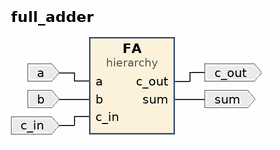
[diagram p0: block diagram of the top level]
# Vivado block design full_adder, xc7z020clg400-1, Vivado 2022.1
create_bd_design full_adder

create_bd_port -dir I a
create_bd_port -dir I b
create_bd_port -dir O c_out
create_bd_port -dir O sum
create_bd_port -dir I c_in

create_bd_cell -type hier FA

# ---- hierarchy /FA ----
current_bd_instance /FA
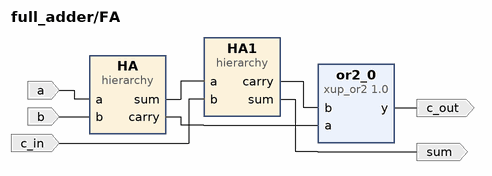
[diagram p1: block diagram inside /FA]
create_bd_pin -dir O c_out
create_bd_pin -dir I a
create_bd_pin -dir I b
create_bd_pin -dir I c_in
create_bd_pin -dir O sum

create_bd_cell -type ip -vlnv xilinx.com:xup:xup_or2:1.0 or2_0
set_property -dict {CONFIG.DELAY 0} [get_bd_cells or2_0]
create_bd_cell -type hier HA
create_bd_cell -type hier HA1

# ---- hierarchy /FA/HA ----
current_bd_instance /FA/HA
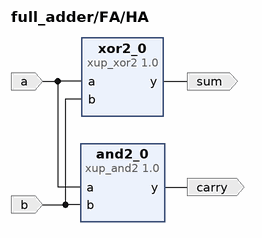
[diagram p2: block diagram inside /FA/HA]
create_bd_pin -dir I a
create_bd_pin -dir I b
create_bd_pin -dir O carry
create_bd_pin -dir O sum

create_bd_cell -type ip -vlnv xilinx.com:xup:xup_and2:1.0 and2_0
set_property -dict {CONFIG.DELAY 0} [get_bd_cells and2_0]
create_bd_cell -type ip -vlnv xilinx.com:xup:xup_xor2:1.0 xor2_0
set_property -dict {CONFIG.DELAY 0} [get_bd_cells xor2_0]

# ---- hierarchy /FA/HA1 ----
current_bd_instance /FA/HA1
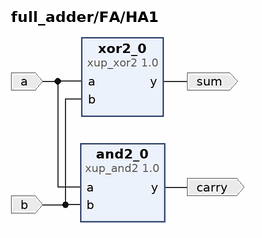
[diagram p3: block diagram inside /FA/HA1]
create_bd_pin -dir I a
create_bd_pin -dir I b
create_bd_pin -dir O carry
create_bd_pin -dir O sum

create_bd_cell -type ip -vlnv xilinx.com:xup:xup_and2:1.0 and2_0
set_property -dict {CONFIG.DELAY 0} [get_bd_cells and2_0]
create_bd_cell -type ip -vlnv xilinx.com:xup:xup_xor2:1.0 xor2_0
set_property -dict {CONFIG.DELAY 0} [get_bd_cells xor2_0]

# ---- connections ----

current_bd_instance /FA
connect_bd_net [get_bd_pins HA1/carry] [get_bd_pins or2_0/b]
connect_bd_net [get_bd_pins HA1/sum] [get_bd_pins sum]
connect_bd_net [get_bd_pins HA/carry] [get_bd_pins or2_0/a]
connect_bd_net [get_bd_pins HA/sum] [get_bd_pins HA1/a]
connect_bd_net [get_bd_pins a] [get_bd_pins HA/a]
connect_bd_net [get_bd_pins b] [get_bd_pins HA/b]
connect_bd_net -net b_2 [get_bd_pins c_in] [get_bd_pins HA1/b]
connect_bd_net [get_bd_pins or2_0/y] [get_bd_pins c_out]

current_bd_instance /FA/HA
connect_bd_net [get_bd_pins a] [get_bd_pins xor2_0/a] [get_bd_pins and2_0/a]
connect_bd_net [get_bd_pins b] [get_bd_pins xor2_0/b] [get_bd_pins and2_0/b]
connect_bd_net -net xup_and2_0_y [get_bd_pins and2_0/y] [get_bd_pins carry]
connect_bd_net -net xup_xor2_0_y [get_bd_pins xor2_0/y] [get_bd_pins sum]

current_bd_instance /FA/HA1
connect_bd_net [get_bd_pins a] [get_bd_pins xor2_0/a] [get_bd_pins and2_0/a]
connect_bd_net [get_bd_pins b] [get_bd_pins xor2_0/b] [get_bd_pins and2_0/b]
connect_bd_net -net xup_and2_0_y [get_bd_pins and2_0/y] [get_bd_pins carry]
connect_bd_net -net xup_xor2_0_y [get_bd_pins xor2_0/y] [get_bd_pins sum]

current_bd_instance /
connect_bd_net -net HA1_sum [get_bd_pins FA/sum] [get_bd_ports sum]
connect_bd_net [get_bd_ports a] [get_bd_pins FA/a]
connect_bd_net [get_bd_ports b] [get_bd_pins FA/b]
connect_bd_net -net b_2 [get_bd_ports c_in] [get_bd_pins FA/c_in]
connect_bd_net -net or2_0_y [get_bd_pins FA/c_out] [get_bd_ports c_out]

validate_bd_design
save_bd_design
